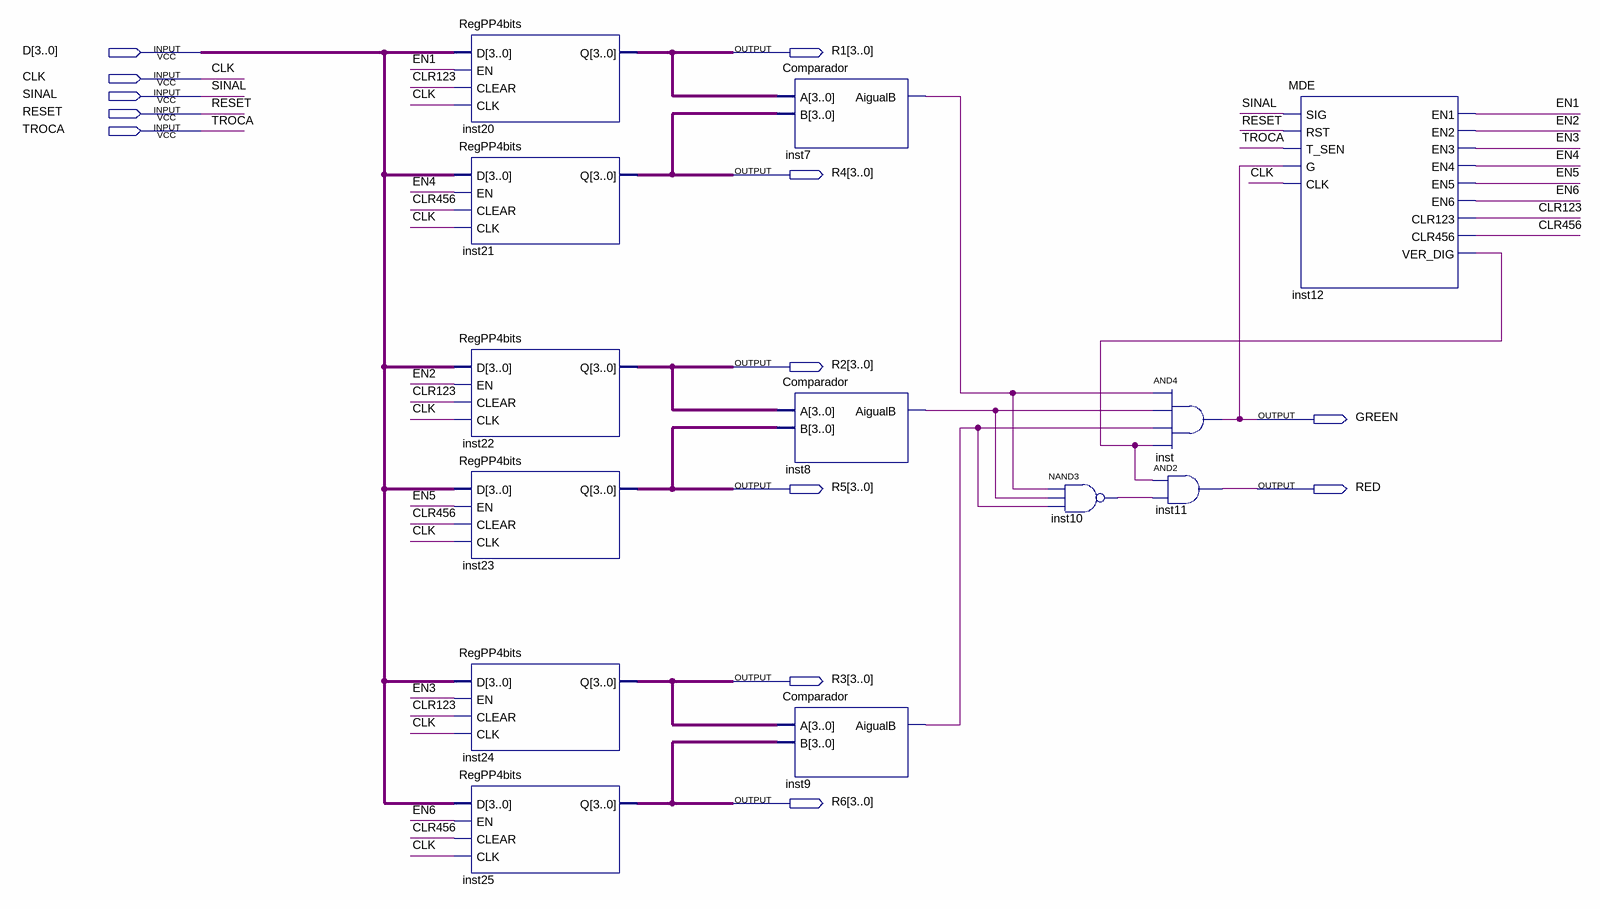
[diagram p0: schematic sheet]
// Quartus schematic Topo0.bdf as structural Verilog: 13 symbols, 13 pins
module Topo0 (
  input  [3:0] D,
  input  CLK,
  input  SINAL,
  input  RESET,
  input  TROCA,
  output [3:0] R1,
  output [3:0] R4,
  output [3:0] R2,
  output GREEN,
  output [3:0] R5,
  output RED,
  output [3:0] R3,
  output [3:0] R6
);

  wire CLR123, CLR456, EN1, EN2, EN3, EN4, EN5, EN6, inst7_aigualb, inst8_aigualb, inst9_aigualb, inst10_out,
       inst12_ver_dig;

  RegPP4bits inst20 (.D(D), .EN(EN1), .CLEAR(CLR123), .CLK(CLK), .Q(R1));
  RegPP4bits inst21 (.D(D), .EN(EN4), .CLEAR(CLR456), .CLK(CLK), .Q(R4));
  RegPP4bits inst22 (.D(D), .EN(EN2), .CLEAR(CLR123), .CLK(CLK), .Q(R2));
  RegPP4bits inst23 (.D(D), .EN(EN5), .CLEAR(CLR456), .CLK(CLK), .Q(R5));
  RegPP4bits inst24 (.D(D), .EN(EN3), .CLEAR(CLR123), .CLK(CLK), .Q(R3));
  RegPP4bits inst25 (.D(D), .EN(EN6), .CLEAR(CLR456), .CLK(CLK), .Q(R6));
  Comparador inst7 (.A(R1), .B(R4), .AigualB(inst7_aigualb));
  Comparador inst8 (.A(R2), .B(R5), .AigualB(inst8_aigualb));
  Comparador inst9 (.A(R3), .B(R6), .AigualB(inst9_aigualb));
  nand inst10 (inst10_out, inst7_aigualb, inst8_aigualb, inst9_aigualb);
  and inst (GREEN, inst7_aigualb, inst8_aigualb, inst9_aigualb, inst12_ver_dig);
  and inst11 (RED, inst12_ver_dig, inst10_out);
  MDE inst12 (
    .SIG(SINAL), .RST(RESET), .T_SEN(TROCA), .G(GREEN), .CLK(CLK), .EN1(EN1), .EN2(EN2), .EN3(EN3),
    .EN4(EN4), .EN5(EN5), .EN6(EN6), .CLR123(CLR123), .CLR456(CLR456), .VER_DIG(inst12_ver_dig));
endmodule
